# EAGLE design CustComp_0.9_SelfEtch (EAGLE 9.5.2)
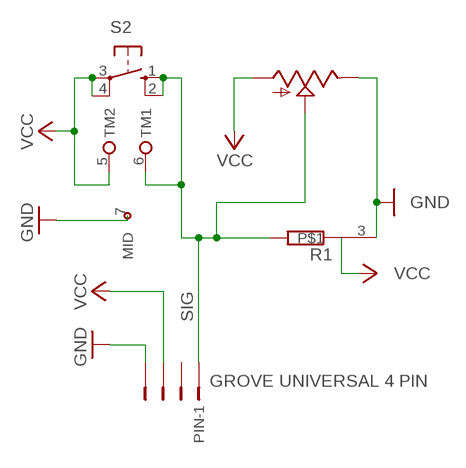
[diagram p0: schematic, sheet 1]

## Parts
PIN  GROVE UNIVERSAL 4 PIN  CON-JST_B4B-ZR  [CON-JST_B4B-ZR]
R1  RES_PULL_UP_DOWNOPPOSING  [RES_PULL_UP_DOWN_OPPOSING]
S2  TERMINAL_TAC_SWITCH  [TERMINAL_TACTILE-PTH]
U$1  SPARKFUN_POT  [SPARKFUN_ALPS_POT]

## Nets
GND: PIN.4 R1.3 S2.7(MID) U$1.P$1(E)
SIG: PIN.1 R1.1 S2.1 S2.2 S2.6(TM1) U$1.P$2(S)
VCC: PIN.3 R1.2 S2.3 S2.4 S2.5(TM2) U$1.P$3(A)
Unconnected: PIN.2

## Library data of the parts
PIN = StudioLab_Grove:CON-JST_?4B-ZR: ZH CONNECTOR 1.5 mm, 4 pin 1 row Source: http://www.jst.com .. eZH.pdf; MF: FARNELL; MPN: S4B-ZR(LF)(SN); OC_FARNELL: 9491830; OC_NEWARK: 38K8076
R1 = StudioLab_Grove:RES_PULL_UP_DOWN: RESISTOR, European symbol
S2 = StudioLab_Grove:TERMINAL_TAC_SWITCH: Momentary Switch Button commonly used for reset or general input. Spark Fun Electronics SKU : COM-00097
U$1 = StudioLab_Grove:SPARKFUN_POT

## Board
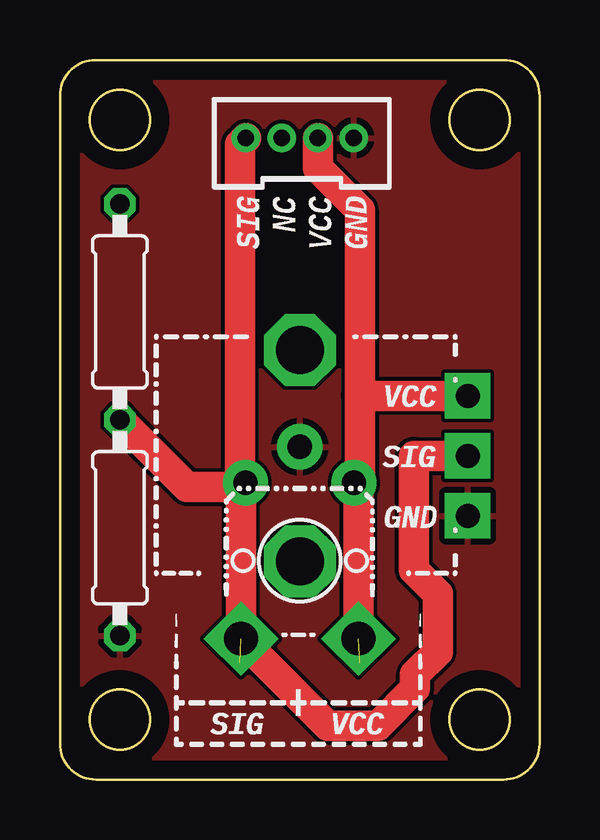
[diagram p1: board, top side]
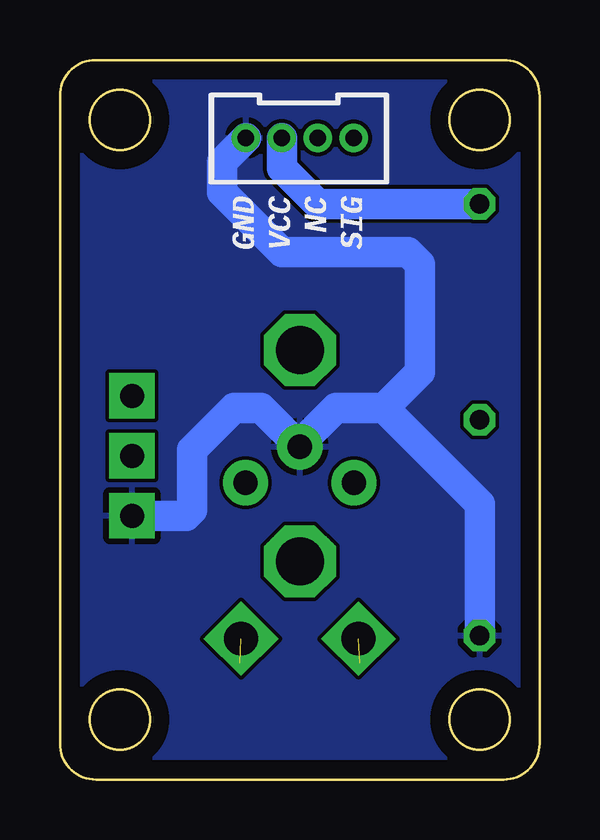
[diagram p2: board, bottom side, seen from below]

Size 20 x 30 mm. Coordinates in mm from the lower left corner, seen from the top.
Outline: 1.5,30 arc90 0,28.5 0,1.5 arc90 1.5,0 18.5,0 arc90 20,1.5 20,28.5 arc90 18.5,30 1.5,30
Outline: circle at 2.5,27.5 radius 1.25
Outline: circle at 17.5,27.5 radius 1.25
Outline: circle at 2.5,2.5 radius 1.25
Outline: circle at 17.5,2.5 radius 1.25
Copper layers (1*16): Top 0.035mm / dielectric 1.5mm / Bottom 0.035mm
Design rules "default *": minimum track width 6mil, minimum drill 0.35mm, track to track 6mil, track to pad 6mil, pad to pad 6mil, via to via 6mil, smd to smd 6mil, copper to edge 30mil, drill to drill 6mil, minimum pad ring 10mil, minimum via ring 8mil, stop-mask expansion 4mil, vias tented up to drill 0mil, thermal gap 10mil

### Footprints (pad centres in the part's own frame; a part is rotated, then mirrored left to right if it is on the bottom)
CON-JST_B4B-ZR = drill 0.7 pad 1.1: 1 -2.25,0; 2 -0.75,0; 3 0.75,0; 4 2.25,0
RES_PULL_UP_DOWN_OPPOSING = drill 0.813 octagon: 1 -0.005,0; 2 8.995,0; 3 -9.005,0
TERMINAL_TACTILE-PTH = drill 1.4 pad 2.2 square: 1 -3.251,2.448; 3 -3.251,-2.448 | drill 1.016 pad 1.88: 2 3.251,2.261; 4 3.251,-2.261; 7 4.75,0 | smd 0.305 x 0.152: 5 -4.25,-2.5; 6 -4.25,2.5
SPARKFUN_ALPS_POT = drill 1 pad 1.88 square: P$1 7,-2.5; P$2 7,0; P$3 7,2.5 | drill 2 octagon: P$4 0,-4.4; P$5 0,4.4

### Placement (x,y rotation side)
PIN  10,26.75 0 top
R1  2.5,15 90 top
S2  10,9.12 90 top
U$1  10,13.5 0 top

### Tracks (layer width: path | path; a pad name or v marks a point on that pad's centre or on a via)
GND
  Bottom 1.27: PIN.4 13.25,25.75 13.25,24.5 10.75,22 5.5,22 5,21.5 5,17 6.5,15.5 | 6.5,15.5 8.5,15.5 10,14 S2.7 11.62,15.5 12.75,15.5 14.5,13.75 14.5,11.25 14.75,11 U$1.P$1 | R1.3 2.5,11.5 6.5,15.5
  pour Top: 0,30 20,30 20,0 0,0
  pour Bottom: -0.5,30.5 20.5,30.5 20.5,-0.5 -0.5,-0.5
SIG  (1 unrouted)
  Top 1.27: PIN.1 7.5,26.5 7.5,12.62 S2.2 7.55,12.19 | 7.55,12.19 S2.1 11.18,2.25 13.25,2.25 14.8,3.8 14.8,4.38 15.75,5.33 15.75,7.75 14.75,8.75 14.75,13.5 U$1.P$2 | R1.1 5.31,12.19 7.55,12.19
VCC  (1 unrouted)
  Top 1.27: PIN.3 10.75,25.5 12.5,23.75 12.5,16 | U$1.P$3 12.5,16 | S2.3 12.45,12.19 S2.4 12.5,12.62 12.5,16
  Bottom 1.27: PIN.3 10.75,25.5 9.24,24 R1.2